# Altium schematic sheet Ctrol_DC.SchDoc
size A4
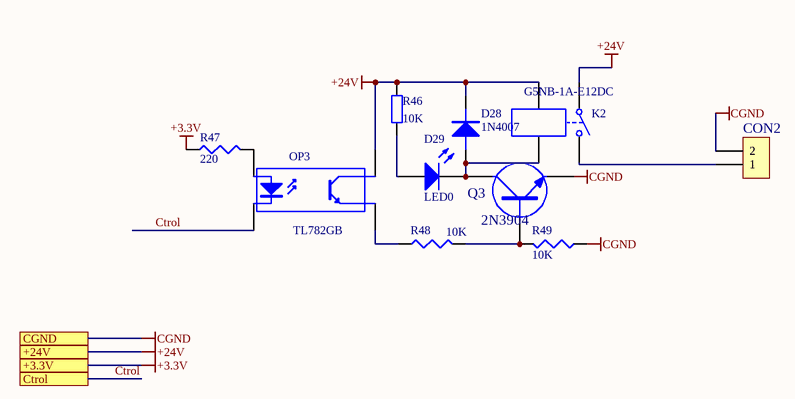
[diagram p0: Ctrol_DC.SchDoc]

## Parts
CON2  (no value)  [DG142V-5.08-2P]
D28  1N4007  [DO-213AB]
D29  LED0  [D0805]
K2  G5NB-1A-E12DC  [G5NB-1A-E]
OP3  TL782GB  [TLV-356]
Q3  2N3904  [SOT-23]
R46  10K  [0603R]
R47  220  [0603R]
R48  10K  [0603R]
R49  10K  [0603R]

## Ports
+3.3V, +24V, CGND, Ctrol

## Nets
+3.3V: R47.1 ; port +3.3V
+24V: D28.2(K) K2.1 K2.2 OP3.4(C) R46.1 ; port +24V
CGND: CON2.2 Q3.2(E) R49.1 ; port CGND
Ctrol: OP3.2(K) ; port Ctrol
NetCON2_1: CON2.1 K2.3
NetD28_1: D28.1(A) D29.2(K) K2.4 Q3.3(C)
NetD29_1: D29.1(A) R46.2
NetOP3_1: OP3.1(A) R47.2
NetOP3_3: OP3.3(E) R48.1
NetQ3_1: Q3.1(B) R48.2 R49.2

## Library data of the parts
CON2 = CON2: Connector
D28 = DIODE
D29 = LED0: Typical INFRARED GaAs LED; Published: 8-Jun-2000; LatestRevisionDate: 08-Jul-2005; LatestRevisionNote: Mech Layer 1 removed.; PackageReference: LED-0; Publisher: Altium Limited; PackageDescription: LED; 2 Leads
K2 = Relay-G5NB-1A-E: Single-Pole Single-Throw Relay; Published: 24-Mar-1999; LatestRevisionDate: 17-Jul-2002; LatestRevisionNote: Re-released for DXP Platform.; PackageReference: MODULE4; Publisher: Altium Limited
OP3 = OPTOISO1: Optoisolator
Q3 = 8050
R46 = Res2: Resistor; Published: 8-Jun-2000; LatestRevisionDate: 17-Jul-2002; LatestRevisionNote: Re-released for DXP Platform.; PackageReference: AXIAL-0.4; Publisher: Altium Limited; PackageDescription: Axial Device, Thru-Hole; 2 Leads; 0.4 in Pin Spacing; Value: 10K
R47-R49 = RES1